# EAGLE design XMICRO-7SEG (EAGLE 6.3)
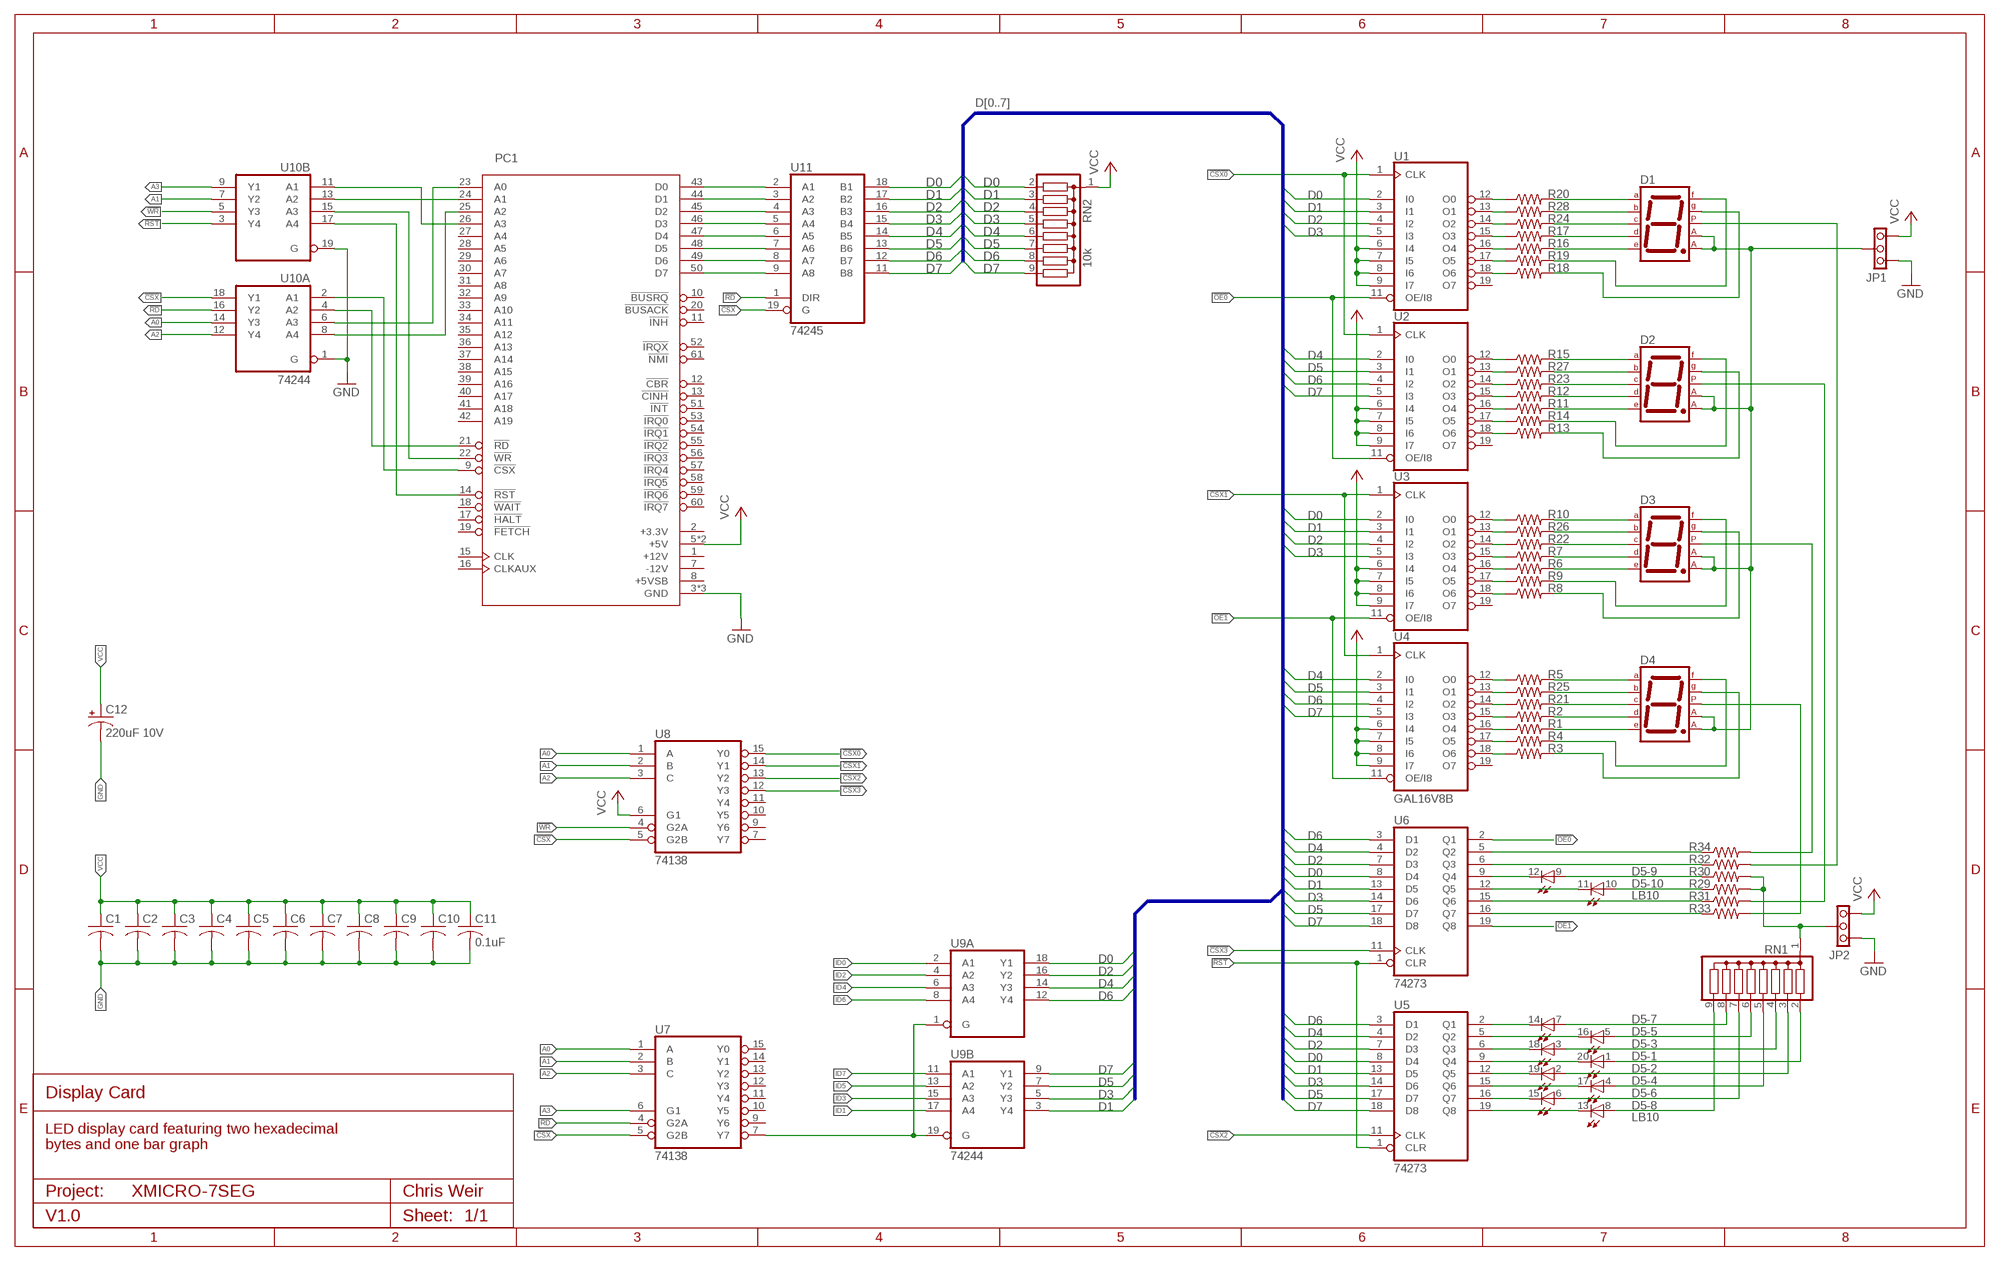
[diagram p0: schematic, sheet 1]

## Parts
C1  0.1uF  C-US025-024X044  [C025-024X044]
C2  0.1uF  C-US025-024X044  [C025-024X044]
C3  0.1uF  C-US025-024X044  [C025-024X044]
C4  0.1uF  C-US025-024X044  [C025-024X044]
C5  0.1uF  C-US025-024X044  [C025-024X044]
C6  0.1uF  C-US025-024X044  [C025-024X044]
C7  0.1uF  C-US025-024X044  [C025-024X044]
C8  0.1uF  C-US025-024X044  [C025-024X044]
C9  0.1uF  C-US025-024X044  [C025-024X044]
C10  0.1uF  C-US025-024X044  [C025-024X044]
C11  0.1uF  C-US025-024X044  [C025-024X044]
C12  220uF 10V  CPOL-US-10-5  [C-10-5]
D1  7SEG-CA  [7SEG-13]
D2  7SEG-CA  [7SEG-13]
D3  7SEG-CA  [7SEG-13]
D4  7SEG-CA  [7SEG-13]
D5  LB10  [LB10]
JP1  PINHD1X3THRU  [1X03]
JP2  PINHD1X3THRU  [1X03]
PC1  XMICRO-BUS-EDGE62M  [EDGE62M]
R1  R-US_0207/10  [0207/10]
R2  R-US_0207/10  [0207/10]
R3  R-US_0207/10  [0207/10]
R4  R-US_0207/10  [0207/10]
R5  R-US_0207/10  [0207/10]
R6  R-US_0207/10  [0207/10]
R7  R-US_0207/10  [0207/10]
R8  R-US_0207/10  [0207/10]
R9  R-US_0207/10  [0207/10]
R10  R-US_0207/10  [0207/10]
R11  R-US_0207/10  [0207/10]
R12  R-US_0207/10  [0207/10]
R13  R-US_0207/10  [0207/10]
R14  R-US_0207/10  [0207/10]
R15  R-US_0207/10  [0207/10]
R16  R-US_0207/10  [0207/10]
R17  R-US_0207/10  [0207/10]
R18  R-US_0207/10  [0207/10]
R19  R-US_0207/10  [0207/10]
R20  R-US_0207/10  [0207/10]
R21  R-US_0207/10  [0207/10]
R22  R-US_0207/10  [0207/10]
R23  R-US_0207/10  [0207/10]
R24  R-US_0207/10  [0207/10]
R25  R-US_0207/10  [0207/10]
R26  R-US_0207/10  [0207/10]
R27  R-US_0207/10  [0207/10]
R28  R-US_0207/10  [0207/10]
R29  R-US_0207/10  [0207/10]
R30  R-US_0207/10  [0207/10]
R31  R-US_0207/10  [0207/10]
R32  R-US_0207/10  [0207/10]
R33  R-US_0207/10  [0207/10]
R34  R-US_0207/10  [0207/10]
RN1  G08R  [SIL9]
RN2  10k  G08R  [SIL9]
U1  GAL16V8B  16V8  [DIL20]
U2  GAL16V8B  16V8  [DIL20]
U3  GAL16V8B  16V8  [DIL20]
U4  GAL16V8B  16V8  [DIL20]
U5  74273  74273N  [DIL20]
U6  74273  74273N  [DIL20]
U7  74138  74LS138N  [DIL16]
U8  74138  74LS138N  [DIL16]
U9  74244  74LS244N  [DIL20]
U10  74244  74LS244N  [DIL20]
U11  74245  74LS245N  [DIL20]

## Nets
!CSX: U7.5(G2B) U8.5(G2B) U10.18(A:Y1) U11.19(G)
!CSX0: U1.1(CLK) U2.1(CLK) U8.15(Y0)
!CSX1: U3.1(CLK) U4.1(CLK) U8.14(Y1)
!CSX2: U5.11(CLK) U8.13(Y2)
!CSX3: U6.11(CLK) U8.12(Y3)
!OE0: U1.11(OE/I8) U2.11(OE/I8) U6.2(Q1)
!OE1: U3.11(OE/I8) U4.11(OE/I8) U6.19(Q8)
!RD: U7.4(G2A) U10.16(A:Y2) U11.1(DIR)
!RST: U5.1(CLR) U6.1(CLR) U10.3(B:Y4)
!WR: U8.4(G2A) U10.5(B:Y3)
A0: U7.1(A) U8.1(A) U10.14(A:Y3)
A1: U7.2(B) U8.2(B) U10.7(B:Y2)
A2: U7.3(C) U8.3(C) U10.12(A:Y4)
A3: U7.6(G1) U10.9(B:Y1)
D0: RN2.2 U1.2(I0) U3.2(I0) U5.8(D4) U6.8(D4) U9.18(A:Y1) U11.18(B1)
D1: RN2.3 U1.3(I1) U3.3(I1) U5.13(D5) U6.13(D5) U9.3(B:Y4) U11.17(B2)
D2: RN2.4 U1.4(I2) U3.4(I2) U5.7(D3) U6.7(D3) U9.16(A:Y2) U11.16(B3)
D3: RN2.5 U1.5(I3) U3.5(I3) U5.14(D6) U6.14(D6) U9.5(B:Y3) U11.15(B4)
D4: RN2.6 U2.2(I0) U4.2(I0) U5.4(D2) U6.4(D2) U9.14(A:Y3) U11.14(B5)
D5: RN2.7 U2.3(I1) U4.3(I1) U5.17(D7) U6.17(D7) U9.7(B:Y2) U11.13(B6)
D6: RN2.8 U2.4(I2) U4.4(I2) U5.3(D1) U6.3(D1) U9.12(A:Y4) U11.12(B7)
D7: RN2.9 U2.5(I3) U4.5(I3) U5.18(D8) U6.18(D8) U9.9(B:Y1) U11.11(B8)
GND [GND]: C1.2 C2.2 C3.2 C4.2 C5.2 C6.2 C7.2 C8.2 C9.2 C10.2 C11.2 C12.- JP1.1 JP2.1 PC1.3(GND) PC1.4(GND) PC1.62(GND) U10.1(A:G) U10.19(B:G)
ID0: U9.2(A:A1)
ID1: U9.17(B:A4)
ID2: U9.4(A:A2)
ID3: U9.15(B:A3)
ID4: U9.6(A:A3)
ID5: U9.13(B:A2)
ID6: U9.8(A:A4)
ID7: U9.11(B:A1)
N$1: D5.12(-9:C) U6.9(Q4)
N$2: D5.11(-10:C) U6.12(Q5)
N$3: R32.1 U6.6(Q3)
N$4: R31.1 U6.15(Q6)
N$5: R33.1 U6.16(Q7)
N$6: D5.1(-1:A) RN1.2
N$7: D5.2(-2:A) RN1.3
N$8: D5.3(-3:A) RN1.4
N$9: D5.4(-4:A) RN1.5
N$10: D5.5(-5:A) RN1.6
N$11: D5.6(-6:A) RN1.7
N$12: D5.7(-7:A) RN1.8
N$13: D5.8(-8:A) RN1.9
N$14: D5.20(-1:C) U5.9(Q4)
N$15: D5.19(-2:C) U5.12(Q5)
N$16: D5.18(-3:C) U5.6(Q3)
N$17: D5.17(-4:C) U5.15(Q6)
N$18: D5.16(-5:C) U5.5(Q2)
N$19: R5.1 U4.12(O0)
N$20: R25.1 U4.13(O1)
N$21: R21.1 U4.14(O2)
N$22: R2.1 U4.15(O3)
N$23: R1.1 U4.16(O4)
N$24: R4.1 U4.17(O5)
N$25: R34.1 U6.5(Q2)
N$26: PC1.43(D0) U11.2(A1)
N$27: R3.1 U4.18(O6)
N$28: D4.7(A) R5.2
N$29: D4.6(B) R25.2
N$30: D4.4(C) R21.2
N$31: D1.3(CA1) D1.8(CA2) D2.3(CA1) D2.8(CA2) D3.3(CA1) D3.8(CA2) D4.3(CA1) D4.8(CA2) JP1.2
N$32: D5.15(-6:C) U5.16(Q7)
N$33: D5.14(-7:C) U5.2(Q1)
N$34: D5.13(-8:C) U5.19(Q8)
N$35: D4.2(D) R2.2
N$36: D4.1(E) R1.2
N$37: D4.9(F) R4.2
N$38: D4.10(G) R3.2
N$39: PC1.44(D1) U11.3(A2)
N$40: PC1.45(D2) U11.4(A3)
N$41: D5.9(-9:A) R30.1
N$42: D5.10(-10:A) R29.1
N$43: PC1.46(D3) U11.5(A4)
N$44: PC1.47(D4) U11.6(A5)
N$45: PC1.48(D5) U11.7(A6)
N$46: D4.5(DP) R33.2
N$47: R10.1 U3.12(O0)
N$48: R26.1 U3.13(O1)
N$49: R22.1 U3.14(O2)
N$50: R7.1 U3.15(O3)
N$51: R6.1 U3.16(O4)
N$52: R9.1 U3.17(O5)
N$53: R8.1 U3.18(O6)
N$54: D3.7(A) R10.2
N$55: D3.6(B) R26.2
N$56: D3.4(C) R22.2
N$57: D3.2(D) R7.2
N$58: D3.1(E) R6.2
N$59: D3.9(F) R9.2
N$60: D3.10(G) R8.2
N$61: PC1.49(D6) U11.8(A7)
N$62: PC1.50(D7) U11.9(A8)
N$63: PC1.9(!CSX) U10.2(A:A1)
N$64: PC1.14(!RST) U10.17(B:A4)
N$65: PC1.21(!RD) U10.4(A:A2)
N$66: PC1.22(!WR) U10.15(B:A3)
N$67: R15.1 U2.12(O0)
N$68: R27.1 U2.13(O1)
N$69: R23.1 U2.14(O2)
N$70: R12.1 U2.15(O3)
N$71: R11.1 U2.16(O4)
N$72: R14.1 U2.17(O5)
N$73: R13.1 U2.18(O6)
N$74: D2.7(A) R15.2
N$75: D2.6(B) R27.2
N$76: D2.4(C) R23.2
N$77: D2.2(D) R12.2
N$78: D2.1(E) R11.2
N$79: D2.9(F) R14.2
N$80: D2.10(G) R13.2
N$81: PC1.23(A0) U10.6(A:A3)
N$82: PC1.24(A1) U10.13(B:A2)
N$83: PC1.25(A2) U10.8(A:A4)
N$84: PC1.26(A3) U10.11(B:A1)
N$85: U7.7(Y7) U9.1(A:G) U9.19(B:G)
N$86: JP2.2 R29.2 R30.2 RN1.1
N$87: R20.1 U1.12(O0)
N$88: R28.1 U1.13(O1)
N$89: R24.1 U1.14(O2)
N$90: R17.1 U1.15(O3)
N$91: R16.1 U1.16(O4)
N$92: R19.1 U1.17(O5)
N$93: R18.1 U1.18(O6)
N$94: D1.7(A) R20.2
N$95: D1.6(B) R28.2
N$96: D1.4(C) R24.2
N$97: D1.2(D) R17.2
N$98: D1.1(E) R16.2
N$99: D1.9(F) R19.2
N$100: D1.10(G) R18.2
N$103: D3.5(DP) R34.2
N$104: D2.5(DP) R31.2
N$105: D1.5(DP) R32.2
VCC: C1.1 C2.1 C3.1 C4.1 C5.1 C6.1 C7.1 C8.1 C9.1 C10.1 C11.1 C12.+ JP1.3 JP2.3 PC1.5(+5V) PC1.6(+5V) RN2.1 U1.6(I4) U1.7(I5) U1.8(I6) U1.9(I7) U2.6(I4) U2.7(I5) U2.8(I6) U2.9(I7) U3.6(I4) U3.7(I5) U3.8(I6) U3.9(I7) U4.6(I4) U4.7(I5) U4.8(I6) U4.9(I7) U8.6(G1)
Unconnected: PC1.1(+12V) PC1.2(+3.3V) PC1.7(-12V) PC1.8(+5VSB) PC1.10(!BUSRQ) PC1.11(!INH) PC1.12(!CBR) PC1.13(!CINH) PC1.15(CLK) PC1.16(CLKAUX) PC1.17(!HALT) PC1.18(!WAIT) PC1.19(!FETCH) PC1.20(!BUSACK) PC1.27(A4) PC1.28(A5) PC1.29(A6) PC1.30(A7) PC1.31(A8) PC1.32(A9) PC1.33(A10) PC1.34(A11) PC1.35(A12) PC1.36(A13) PC1.37(A14) PC1.38(A15) PC1.39(A16) PC1.40(A17) PC1.41(A18) PC1.42(A19) PC1.51(!INT) PC1.52(!IRQX) PC1.53(!IRQ0) PC1.54(!IRQ1) PC1.55(!IRQ2) PC1.56(!IRQ3) PC1.57(!IRQ4) PC1.58(!IRQ5) PC1.59(!IRQ6) PC1.60(!IRQ7) PC1.61(!NMI) U1.19(O7) U2.19(O7) U3.19(O7) U4.19(O7) U7.9(Y6) U7.10(Y5) U7.11(Y4) U7.12(Y3) U7.13(Y2) U7.14(Y1) U7.15(Y0) U8.7(Y7) U8.9(Y6) U8.10(Y5) U8.11(Y4)

## Buses
D[0..7]

## Notes on the sheet
- Display Card
- LED display card featuring two hexadecimal
  bytes and one bar graph
- Project: | Chris Weir
- V1.0 | Sheet:

## Power pins joined to a net without a drawn wire
GND: U1.10(GND) U2.10(GND) U3.10(GND) U4.10(GND) U5.10(GND) U6.10(GND) U7.8(GND) U8.8(GND) U9.10(P:GND) U10.10(P:GND) U11.10(GND)
VCC: U1.20(VCC) U2.20(VCC) U3.20(VCC) U4.20(VCC) U5.20(VCC) U6.20(VCC) U7.16(VCC) U8.16(VCC) U9.20(P:VCC) U10.20(P:VCC) U11.20(VCC)

## Library data of the parts
C1-C11 = resistor:C-US: CAPACITOR, American symbol
C12 = Custom:CPOL-US
D1-D4 = special:7SEG-CA: 7-segment DISPLAY single anode, 13 mm
D5 = led:LB10: LED BLOCK 10-LED bar graph, DIL, Siemens
JP1 JP2 = Custom:PINHD1X3THRU
PC1 = Custom:XMICRO-BUS
R1-R34 = resistor:R-US_: RESISTOR, American symbol
RN1 RN2 = resistor-sil:G08R: SIL RESISTOR; OC_FARNELL: unknown; OC_NEWARK: unknown
U1-U4 = pal:16V8: PAL; MPN: GAL16V8D-7LPN; OC_FARNELL: 9699740; OC_NEWARK: 97K0449
U5 U6 = 74xx-us:74*273: Octal D type FLIP FLOP, clear
U7 U8 = 74xx-us:74*138: 3-line to 8-line DECODER/DEMULTIPLEXER
U9 U10 = 74xx-us:74*244: Octal BUFFER and LINE DRIVER, 3-state
U11 = 74xx-us:74*245: Octal BUS TRANSCEIVER, 3-state

## Net classes
1 GND: width 0.254 mm, clearance 0.381 mm

## Board
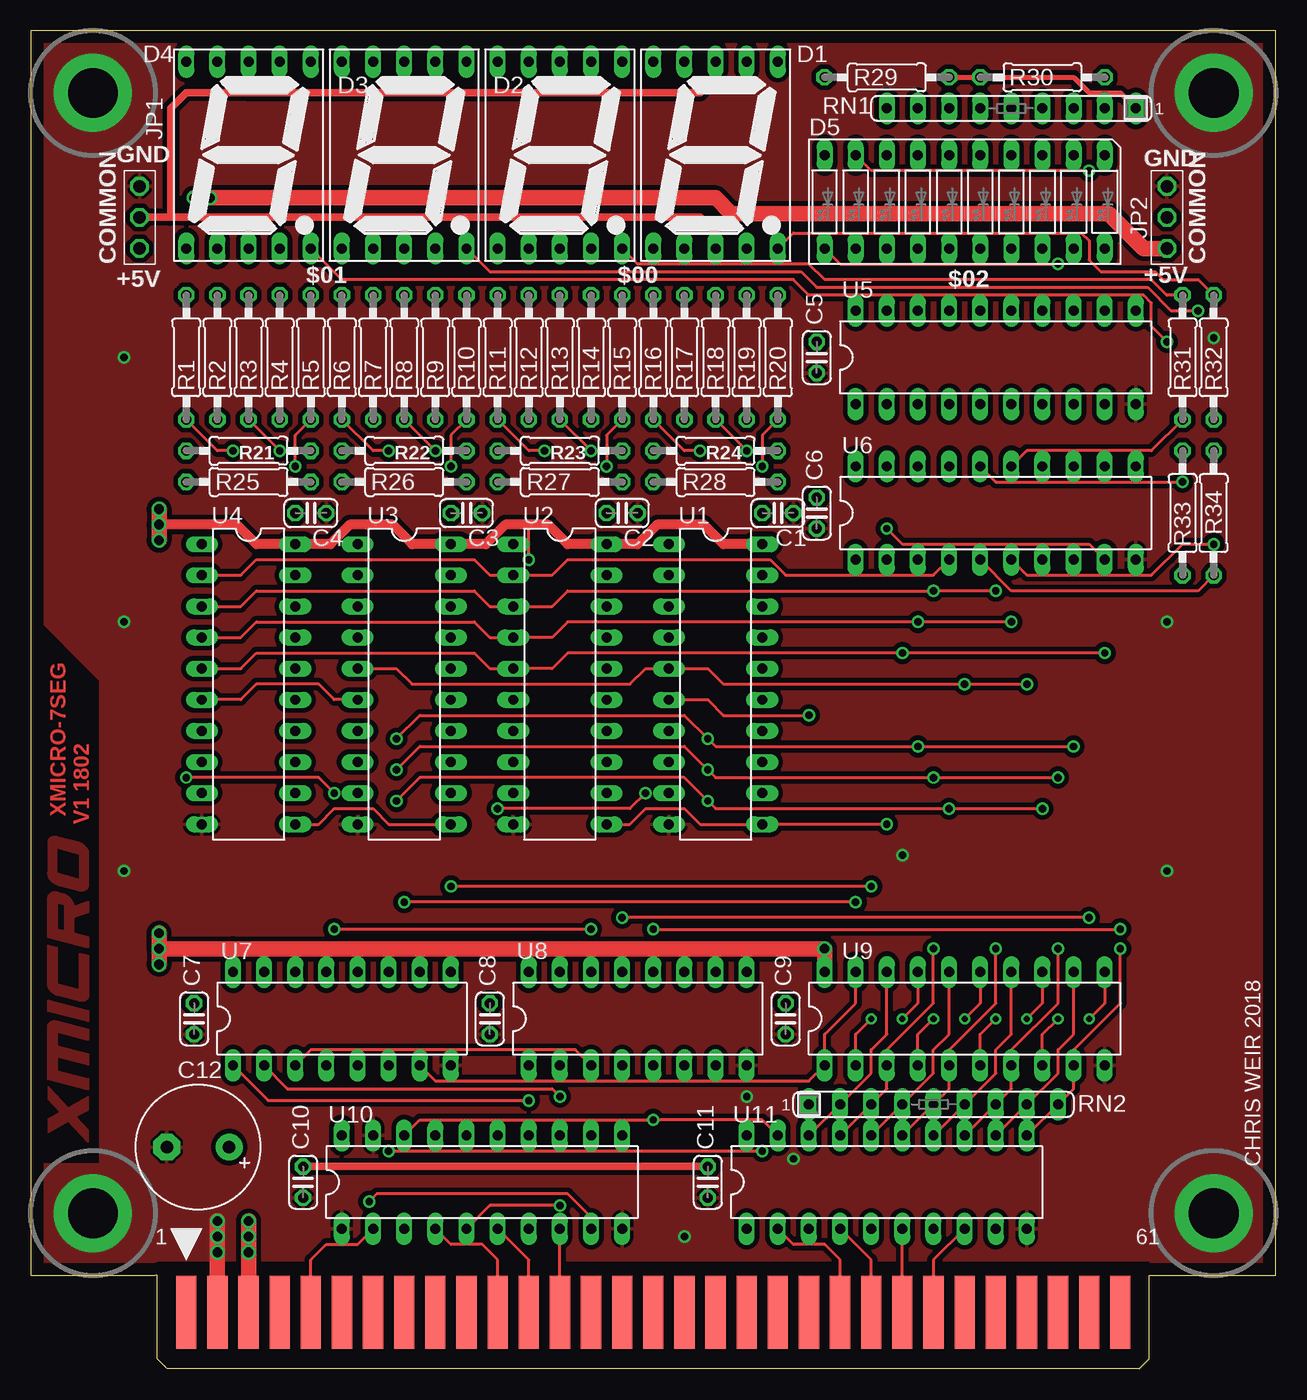
[diagram p1: board, top side]
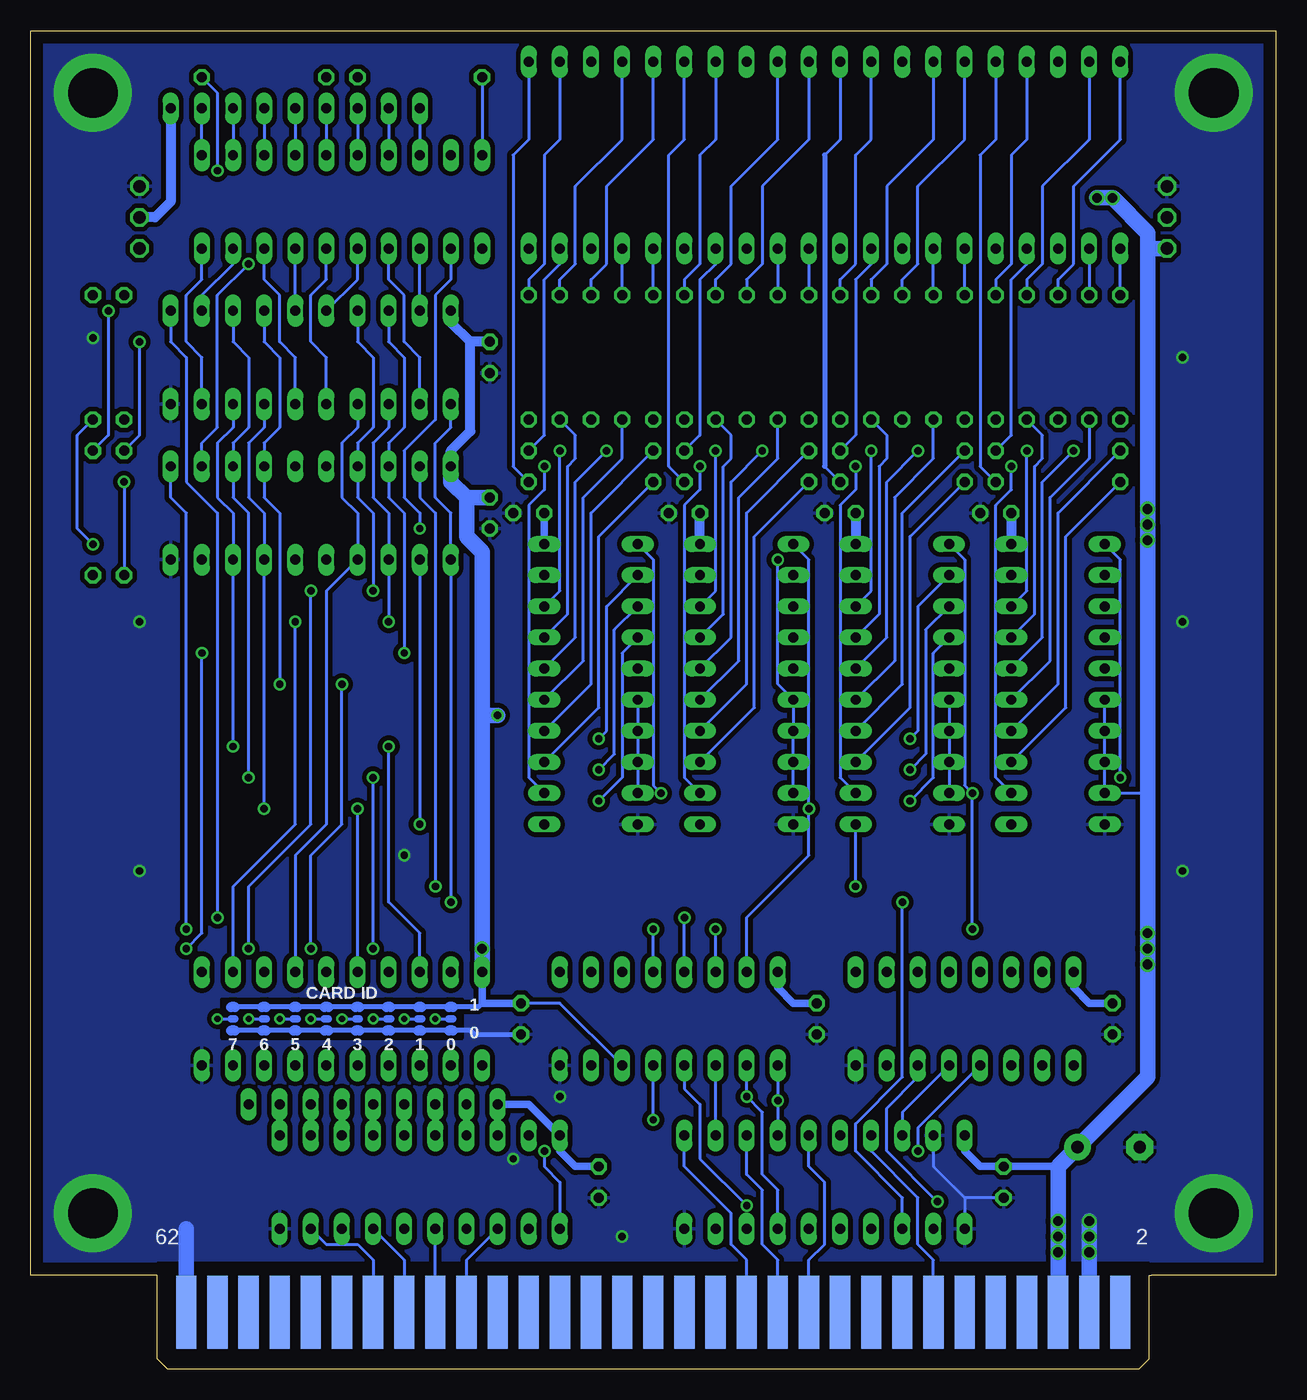
[diagram p2: board, bottom side, seen from below]

Size 101.6 x 109.22 mm. Coordinates in mm from the lower left corner, seen from the top.
Outline: 10.16,7.62 0,7.62 0,109.22 101.6,109.22 101.6,7.62 91.44,7.62
Copper layers (1*16): Top 0.035mm / dielectric 1.5mm / Bottom 0.035mm
Design rules "default *": minimum track width 10mil, minimum drill 0.3mm, track to track 10mil, track to pad 10mil, pad to pad 10mil, via to via 10mil, smd to smd 10mil, copper to edge 40mil, drill to drill 10mil, minimum pad ring 10mil, minimum via ring 8mil, stop-mask expansion 4mil, vias tented up to drill 25mil, thermal gap 10mil
bRestrict: area 66.4,27 to 86,30.2

### Footprints (pad centres in the part's own frame; a part is rotated, then mirrored left to right if it is on the bottom)
C025-024X044 = drill 0.813 octagon: 1 -1.27,0; 2 1.27,0
C-10-5 = drill 1.016 pad 2.184: + -2.54,0 | drill 1.016 pad 2.184 octagon: - 2.54,0
7SEG-13 = drill 0.813 long: 1 -5.08,-7.62; 2 -2.54,-7.62; 3 0,-7.62; 4 2.54,-7.62; 5 5.08,-7.62; 6 5.08,7.62; 7 2.54,7.62; 8 0,7.62; 9 -2.54,7.62; 10 -5.08,7.62
LB10 = drill 0.813 long: 1 -11.43,-3.81; 2 -8.89,-3.81; 3 -6.35,-3.81; 4 -3.81,-3.81; 5 -1.27,-3.81; 6 1.27,-3.81; 7 3.81,-3.81; 8 6.35,-3.81; 9 8.89,-3.81; 10 11.43,-3.81; 11 11.43,3.81; 12 8.89,3.81; 13 6.35,3.81; 14 3.81,3.81; 15 1.27,3.81; 16 -1.27,3.81; 17 -3.81,3.81; 18 -6.35,3.81; 19 -8.89,3.81; 20 -11.43,3.81
1X03 = drill 1.016 octagon: 1 -2.54,0; 2 0,0; 3 2.54,0
EDGE62M = smd 1.651 x 5.969: 1 -38.1,-3.01; 3 -35.56,-3.01; 5 -33.02,-3.01; 7 -30.48,-3.01; 9 -27.94,-3.01; 11 -25.4,-3.01; 13 -22.86,-3.01; 15 -20.32,-3.01; 17 -17.78,-3.01; 19 -15.24,-3.01; 21 -12.7,-3.01; 23 -10.16,-3.01; 25 -7.62,-3.01; 27 -5.08,-3.01; 29 -2.54,-3.01; 31 0,-3.01; 33 2.54,-3.01; 35 5.08,-3.01; 37 7.62,-3.01; 39 10.16,-3.01; 41 12.7,-3.01; 43 15.24,-3.01; 45 17.78,-3.01; 47 20.32,-3.01; 49 22.86,-3.01; 51 25.4,-3.01; 53 27.94,-3.01; 55 30.48,-3.01; 57 33.02,-3.01; 59 35.56,-3.01; 61 38.1,-3.01 | smd 1.651 x 5.969 bottom: 2 -38.1,-3.01; 4 -35.56,-3.01; 6 -33.02,-3.01; 8 -30.48,-3.01; 10 -27.94,-3.01; 12 -25.4,-3.01; 14 -22.86,-3.01; 16 -20.32,-3.01; 18 -17.78,-3.01; 20 -15.24,-3.01; 22 -12.7,-3.01; 24 -10.16,-3.01; 26 -7.62,-3.01; 28 -5.08,-3.01; 30 -2.54,-3.01; 32 0,-3.01; 34 2.54,-3.01; 36 5.08,-3.01; 38 7.62,-3.01; 40 10.16,-3.01; 42 12.7,-3.01; 44 15.24,-3.01; 46 17.78,-3.01; 48 20.32,-3.01; 50 22.86,-3.01; 52 25.4,-3.01; 54 27.94,-3.01; 56 30.48,-3.01; 58 33.02,-3.01; 60 35.56,-3.01; 62 38.1,-3.01
0207/10 = drill 0.813 octagon: 1 -5.08,0; 2 5.08,0
SIL9 = drill 0.813 long: 1 -10.16,0; 2 -7.62,0; 3 -5.08,0; 4 -2.54,0; 5 0,0; 6 2.54,0; 7 5.08,0; 8 7.62,0; 9 10.16,0
DIL20 = drill 0.813 long: 1 -11.43,-3.81; 2 -8.89,-3.81; 3 -6.35,-3.81; 4 -3.81,-3.81; 5 -1.27,-3.81; 6 1.27,-3.81; 7 3.81,-3.81; 8 6.35,-3.81; 9 8.89,-3.81; 10 11.43,-3.81; 11 11.43,3.81; 12 8.89,3.81; 13 6.35,3.81; 14 3.81,3.81; 15 1.27,3.81; 16 -1.27,3.81; 17 -3.81,3.81; 18 -6.35,3.81; 19 -8.89,3.81; 20 -11.43,3.81
DIL16 = drill 0.813 long: 1 -8.89,-3.81; 2 -6.35,-3.81; 3 -3.81,-3.81; 4 -1.27,-3.81; 5 1.27,-3.81; 6 3.81,-3.81; 7 6.35,-3.81; 8 8.89,-3.81; 9 8.89,3.81; 10 6.35,3.81; 11 3.81,3.81; 12 1.27,3.81; 13 -1.27,3.81; 14 -3.81,3.81; 15 -6.35,3.81; 16 -8.89,3.81

### Placement (x,y rotation side)
C1  60.96,69.85 0 top
C2  48.26,69.85 0 top
C3  35.56,69.85 0 top
C4  22.86,69.85 0 top
C5  64.14,82.55 270 top
C6  64.14,69.85 270 top
C7  13.34,28.57 270 top
C8  37.47,28.57 270 top
C9  61.59,28.57 270 top
C10  22.23,15.24 270 top
C11  55.24,15.24 270 top
C12  13.65,18.1 180 top
D1  55.88,99.06 0 top
D2  43.18,99.06 0 top
D3  30.48,99.06 0 top
D4  17.78,99.06 0 top
D5  76.2,95.25 180 top
JP1  8.89,93.98 270 top
JP2  92.71,93.98 270 top
PC1  50.8,7.62 0 top
R1  12.7,82.55 90 top
R2  15.24,82.55 90 top
R3  17.78,82.55 90 top
R4  20.32,82.55 90 top
R5  22.86,82.55 90 top
R6  25.4,82.55 90 top
R7  27.94,82.55 90 top
R8  30.48,82.55 90 top
R9  33.02,82.55 90 top
R10  35.56,82.55 90 top
R11  38.1,82.55 90 top
R12  40.64,82.55 90 top
R13  43.18,82.55 90 top
R14  45.72,82.55 90 top
R15  48.26,82.55 90 top
R16  50.8,82.55 90 top
R17  53.34,82.55 90 top
R18  55.88,82.55 90 top
R19  58.42,82.55 90 top
R20  60.96,82.55 90 top
R21  17.78,74.93 0 top
R22  30.48,74.93 0 top
R23  43.18,74.93 0 top
R24  55.88,74.93 0 top
R25  17.78,72.39 0 top
R26  30.48,72.39 0 top
R27  43.18,72.39 0 top
R28  55.88,72.39 0 top
R29  69.85,105.41 0 top
R30  82.55,105.41 180 top
R31  93.98,82.55 90 top
R32  96.52,82.55 90 top
R33  93.98,69.85 90 top
R34  96.52,69.85 90 top
RN1  80.01,102.87 180 top
RN2  73.66,21.59 0 top
U1  55.88,55.88 270 top
U2  43.18,55.88 270 top
U3  30.48,55.88 270 top
U4  17.78,55.88 270 top
U5  78.74,82.55 0 top
U6  78.74,69.85 0 top
U7  25.4,28.57 0 top
U8  49.53,28.57 0 top
U9  76.2,28.57 0 top
U10  36.83,15.24 0 top
U11  69.85,15.24 0 top

### Tracks (layer width: path | path; a pad name or v marks a point on that pad's centre or on a via)
!CSX  (via drill 0.6)
  Top 0.254: U10.18 31.75,20.32 v50.8,20.32 59.69,20.32 U11.19
  Bottom 0.254: v50.8,20.32 U8.5 | U7.5 30.48,20.96 U10.18
!CSX0  (via drill 0.6)
  Top 0.254: v50.16,46.99 48.9,45.72 v38.1,45.72
  Bottom 0.254: U1.1 50.8,66.04 50.8,47.62 v50.16,46.99 | U2.1 38.1,66.04 v38.1,45.72 38.1,41.91 43.18,36.83 U8.15
!CSX1  (via drill 0.6)
  Top 0.254: v24.77,46.99 23.5,48.26 v12.7,48.26 | v45.72,35.88 v24.77,35.88
  Bottom 0.254: U3.1 25.4,66.04 25.4,47.62 v24.77,46.99 v24.77,35.88 | v12.7,48.26 12.7,66.04 U4.1 | U8.14 v45.72,35.88
!CSX2  (via drill 0.6)
  Top 0.254: v86.36,36.83 v48.26,36.83
  Bottom 0.254: U8.13 v48.26,36.83 | v86.36,36.83 86.36,69.85 88.9,72.39 88.9,82.55 90.17,83.82 U5.11
!CSX3  (via drill 0.6)
  Top 0.254: v50.8,35.88 v88.9,35.88
  Bottom 0.254: U8.12 v50.8,35.88 | v88.9,35.88 88.9,69.85 90.17,71.12 U6.11
!OE0  (via drill 0.6)
  Top 0.254: U2.11 48.9,44.45 50.16,45.72 53.34,45.72 54.61,44.45 U1.11 v69.85,44.45
  Bottom 0.254: U6.2 v69.85,44.45
!OE1  (via drill 0.6)
  Top 0.254: U4.11 23.5,44.45 24.77,45.72 27.94,45.72 29.21,44.45 U3.11 | v68.58,39.37 v34.29,39.37
  Bottom 0.254: U6.19 69.85,71.12 68.58,69.85 v68.58,39.37 | v34.29,39.37 U3.11
!RD  (via drill 0.6)
  Top 0.254: U10.16 35.56,17.78 | 35.56,17.78 v59.69,17.78 | v29.21,17.78 35.56,17.78
  Bottom 0.254: v59.69,17.78 59.69,16.51 58.42,15.24 U11.1 | U7.4 29.21,19.68 v29.21,17.78
!RST  (via drill 0.6)
  Top 0.254: v67.31,38.1 v30.48,38.1
  Bottom 0.254: U5.1 67.31,76.84 68.58,75.56 68.58,71.12 67.31,69.85 U6.1 v67.31,38.1 | U10.3 30.48,13.97 34.29,17.78 34.29,20 30.48,23.81 v30.48,38.1
!WR  (via drill 0.6)
  Top 0.254: v43.18,13.34 37.47,13.34 U10.5
  Bottom 0.254: U8.4 48.26,22.86 46.99,21.59 46.99,17.14 v43.18,13.34
A0  (via drill 0.6)
  Top 0.254: U7.1 19.37,21.91 v40.64,21.91
  Bottom 0.254: U8.1 v40.64,21.91 U10.14
A1  (via drill 0.6)
  Top 0.254: U7.2 20.95,22.86 42.55,22.86 v43.18,22.23
  Bottom 0.254: U10.7 40.64,14.61 41.91,15.88 41.91,20.96 v43.18,22.23 U8.2
A2
  Top 0.254: U8.3 44.45,26.04 22.86,26.04 U7.3
  Bottom 0.254: U10.12 U8.3
A3  (via drill 0.6)
  Top 0.254: U10.9 45.72,12.38 43.81,14.29 28.26,14.29 v27.62,13.65
  Bottom 0.254: v27.62,13.65 31.75,17.78 31.75,21.27 29.21,23.81 U7.6
D0  (via drill 0.6)
  Top 0.254: v29.84,51.43 31.75,53.34 53.34,53.34 v55.24,51.43 55.88,50.8 v72.39,50.8 v85.09,50.8 | U9.18 69.85,27.3 68.58,26.04 68.58,24.13 RN2.2 U11.18
  Bottom 0.254: U5.8 85.09,76.84 86.36,75.56 86.36,71.12 85.09,69.85 U6.8 v85.09,50.8 | U3.2 29.21,62.23 29.21,52.07 v29.84,51.43 | v55.24,51.43 54.61,52.07 54.61,62.23 U1.2 | U9.18 69.85,35.56 72.39,38.1 v72.39,50.8
D1  (via drill 0.6)
  Top 0.254: v29.84,48.89 31.75,50.8 53.34,50.8 v55.24,48.89 55.88,48.26 v73.66,48.26 v83.82,48.26 | v73.66,34.29 73.66,29.85 69.85,26.04 U9.3 69.85,22.86 RN2.3 U11.17
  Bottom 0.254: U5.13 85.09,83.82 83.82,82.55 83.82,76.84 85.09,75.56 U6.13 85.09,71.12 83.82,69.85 v83.82,48.26 | U3.3 28.57,60.32 28.57,50.16 v29.84,48.89 | v55.24,48.89 53.98,50.16 53.98,60.32 U1.3 | v73.66,34.29 v73.66,48.26
D2  (via drill 0.6)
  Top 0.254: v29.84,46.35 31.75,48.26 53.34,48.26 v55.24,46.35 55.88,45.72 v74.93,45.72 v82.55,45.72 | U9.16 74.93,27.3 73.66,26.04 73.66,24.13 RN2.4 U11.16
  Bottom 0.254: U5.7 82.55,76.84 83.82,75.56 83.82,71.12 82.55,69.85 U6.7 v82.55,45.72 | U1.4 53.34,58.42 53.34,48.26 v55.24,46.35 | v29.84,46.35 27.94,48.26 27.94,58.42 U3.4 | U9.16 v74.93,45.72
D3  (via drill 0.6)
  Top 0.254: U3.5 29.84,57.15 31.11,55.88 48.9,55.88 50.16,57.15 U1.5 55.24,57.15 56.52,55.88 v76.2,55.88 v81.28,55.88 | v78.74,34.29 78.74,29.85 74.93,26.04 U9.5 74.93,22.86 RN2.5 U11.15
  Bottom 0.254: U5.14 82.55,83.82 81.28,82.55 81.28,76.84 82.55,75.56 U6.14 82.55,71.12 81.28,69.85 v81.28,55.88 | v78.74,34.29 78.74,41.91 76.2,44.45 v76.2,55.88
D4
  Top 0.254: U4.2 17.14,64.77 18.41,66.04 36.2,66.04 37.47,64.77 U2.2 42.55,64.77 43.81,66.04 60.33,66.04 61.59,64.77 73.66,64.77 U6.4 | U11.14 74.3,19.68 RN2.6 78.74,24.13 78.74,26.04 80.01,27.3 U9.14
  Bottom 0.254: U5.4 74.93,76.84 76.2,75.56 76.2,71.12 74.93,69.85 U6.4 77.47,63.5 77.47,44.45 80.01,41.91 U9.14
D5  (via drill 0.6)
  Top 0.254: U4.3 17.14,62.23 18.41,63.5 36.2,63.5 37.47,62.23 U2.3 42.55,62.23 43.81,63.5 v73.66,63.5 v78.74,63.5 | v83.82,34.29 83.82,29.85 80.01,26.04 U9.7 80.01,22.86 RN2.7 U11.13
  Bottom 0.254: U5.17 74.93,83.82 73.66,82.55 73.66,76.84 74.93,75.56 U6.17 74.93,71.12 73.66,69.85 v73.66,63.5 | v83.82,34.29 83.82,39.37 78.74,44.45 v78.74,63.5
D6  (via drill 0.6)
  Top 0.254: U4.4 17.14,59.69 18.41,60.96 36.2,60.96 37.47,59.69 U2.4 42.55,59.69 43.81,60.96 v72.39,60.96 v80.01,60.96 | U9.12 85.09,27.3 83.82,26.04 83.82,24.13 RN2.8 U11.12
  Bottom 0.254: U5.3 72.39,76.84 73.66,75.56 73.66,71.12 72.39,69.85 U6.3 v72.39,60.96 | U9.12 85.09,39.37 80.01,44.45 v80.01,60.96
D7  (via drill 0.6)
  Top 0.254: U4.5 17.14,57.15 18.41,58.42 36.2,58.42 37.47,57.15 U2.5 42.55,57.15 43.81,58.42 v71.12,58.42 v87.63,58.42 | v88.9,34.29 88.9,29.85 85.09,26.04 U9.9 85.09,22.86 RN2.9 U11.11
  Bottom 0.254: U5.18 72.39,83.82 71.12,82.55 71.12,76.84 72.39,75.56 U6.18 72.39,71.12 71.12,69.85 v71.12,58.42 | v88.9,34.29 87.63,35.56 v87.63,58.42
GND  (via drill 0.6, 0.8, 4.06 pad 6.35)
  Top 1.27: PC1.4 v15.24,9.53 v15.24,10.79 v15.24,12.07
  Bottom 0.254: U10.19 27.94,16.51 25.4,13.97 | 25.4,13.97 U10.1 | C10.2 25.4,13.97
  Bottom 0.406: 67.15,27.62 65.72,27.62 65.41,27.3 C9.2 | 67.47,27.62 69.69,27.62 | 70.01,27.62 72.23,27.62 | 72.55,27.62 74.77,27.62 | 75.09,27.62 77.31,27.62 | 77.63,27.62 79.85,27.62 | 80.17,27.62 82.39,27.62 | 82.71,27.62 84.93,27.62
  Bottom 0.813: 67.15,27.62 67.47,27.62 | 69.69,27.62 70.01,27.62 | 72.23,27.62 72.55,27.62 | 74.77,27.62 75.09,27.62 | 77.31,27.62 77.63,27.62 | 79.85,27.62 80.17,27.62 | 82.39,27.62 82.71,27.62 | 84.93,27.62 85.25,27.62
  Bottom 1.27: PC1.4 v15.24,9.53 v15.24,10.79 v15.24,12.07 | PC1.62 88.9,11.43
  other vias: 96.52,12.7 5.08,12.7 96.52,104.14 5.08,104.14 7.62,40.64 7.62,60.96 7.62,82.55 71.12,41.91 92.71,40.64 92.71,60.96 96.52,84.14 58.42,22.23 62.23,17.14 53.34,10.79
  pour Bottom: 91.44,7.62 101.6,7.62 101.6,109.22 0,109.22 0,7.62 10.16,7.62 10.16,8.89 91.44,8.89
  pour Top: 0,7.62 0,16.64 5.71,16.64 5.71,56.2 0,61.91 0,109.22 101.6,109.22 101.6,7.62 91.44,7.62 91.44,8.89 10.16,8.89 10.16,7.62
ID0  (via drill 0.5)
  Top 0.254: U9.2 67.31,27.3 v68.58,28.57
  Bottom 0.254: v68.58,28.57 67.47,28.57
  Bottom 0.61: 67.47,28.57 67.15,28.57
ID1  (via drill 0.5)
  Top 0.254: U9.17 72.39,29.85 v71.12,28.57
  Bottom 0.254: v71.12,28.57 70.01,28.57
  Bottom 0.61: 70.01,28.57 69.69,28.57
ID2  (via drill 0.5)
  Top 0.254: U9.4 72.39,27.3 v73.66,28.57
  Bottom 0.254: v73.66,28.57 72.55,28.57
  Bottom 0.61: 72.55,28.57 72.23,28.57
ID3  (via drill 0.5)
  Top 0.254: U9.15 77.47,29.85 v76.2,28.57
  Bottom 0.254: v76.2,28.57 75.09,28.57
  Bottom 0.61: 75.09,28.57 74.77,28.57
ID4  (via drill 0.5)
  Top 0.254: U9.6 77.47,27.3 v78.74,28.57
  Bottom 0.254: v78.74,28.57 77.63,28.57
  Bottom 0.61: 77.63,28.57 77.31,28.57
ID5  (via drill 0.5)
  Top 0.254: U9.13 82.55,29.85 v81.28,28.57
  Bottom 0.254: v81.28,28.57 80.17,28.57
  Bottom 0.61: 80.17,28.57 79.85,28.57
ID6  (via drill 0.5)
  Top 0.254: U9.8 82.55,27.3 v83.82,28.57
  Bottom 0.254: v83.82,28.57 82.71,28.57
  Bottom 0.61: 82.71,28.57 82.39,28.57
ID7  (via drill 0.5)
  Top 0.254: U9.11 87.63,29.85 v86.36,28.57
  Bottom 0.254: v86.36,28.57 85.25,28.57
  Bottom 0.61: 85.25,28.57 84.93,28.57
N$1  (via drill 0.6)
  Top 0.254: v69.85,68.58 71.12,67.31 86.36,67.31 U6.9
  Bottom 0.254: D5.12 67.31,88.9 68.58,87.63 68.58,77.47 71.12,74.93 71.12,71.12 69.85,69.85 v69.85,68.58
N$2  (via drill 0.6)
  Top 0.254: D5.11 66.04,90.17 v83.82,90.17
  Bottom 0.254: U6.12 87.63,75.56 86.36,76.84 86.36,87.63 v83.82,90.17
N$3  (via drill 0.6)
  Top 0.254: U6.6 81.28,64.77 91.44,64.77 93.98,67.31 v96.52,67.31
  Bottom 0.254: v96.52,67.31 97.79,68.58 97.79,76.2 R32.1
N$4
  Top 0.254: R31.1 91.44,74.93 81.28,74.93 U6.15
N$5  (via drill 0.6)
  Top 0.254: U6.16 78.74,72.39 v93.98,72.39
  Bottom 0.254: v93.98,72.39 R33.1
N$6
  Bottom 0.254: D5.1 RN1.2
N$7
  Bottom 0.254: RN1.3 D5.2
N$8
  Bottom 0.254: RN1.4 D5.3
N$9
  Bottom 0.254: RN1.5 D5.4
N$10
  Bottom 0.254: RN1.6 D5.5
N$11
  Bottom 0.254: RN1.7 D5.6
N$12
  Bottom 0.254: RN1.8 D5.7
N$13
  Bottom 0.254: RN1.9 D5.8
N$14
  Bottom 0.254: U5.9 87.63,82.55 88.9,83.82 88.9,87.63 87.63,88.9 D5.20
N$15
  Bottom 0.254: U5.12 87.63,87.63 85.09,90.17 D5.19
N$16
  Bottom 0.254: U5.6 80.01,82.55 81.28,83.82 81.28,87.63 82.55,88.9 D5.18
N$17
  Bottom 0.254: U5.15 D5.17
N$18
  Bottom 0.254: U5.5 77.47,82.55 78.74,83.82 78.74,87.63 77.47,88.9 D5.16
N$19  (via drill 0.6)
  Top 0.254: v21.59,73.66 21.59,76.2 R5.1
  Bottom 0.254: U4.12 22.86,48.26 22.86,70.48 21.59,71.76 v21.59,73.66
N$20
  Bottom 0.254: U4.13 17.14,53.97 17.14,67.95 R25.1
N$21
  Bottom 0.254: U4.14 17.78,55.88 17.78,69.85 R21.1
N$22
  Bottom 0.254: U4.15 18.41,57.78 18.41,71.12 15.24,74.3 R2.1
N$23  (via drill 0.6)
  Top 0.254: v16.51,74.93 15.24,74.93 R1.1
  Bottom 0.254: U4.16 19.05,59.69 19.05,72.39 v16.51,74.93
N$24
  Bottom 0.254: U4.17 19.68,61.59 19.68,73.66 19.05,74.3 19.05,76.2 R4.1
N$25
  Top 0.254: R34.1 95.25,63.5 80.01,63.5 U6.5
N$26
  Top 0.254: PC1.43 66.04,8.89 64.77,10.16 62.23,10.16 U11.2
N$27  (via drill 0.6)
  Top 0.254: R3.1 v20.32,74.93
  Bottom 0.254: U4.18 20.32,63.5 v20.32,74.93
N$28
  Bottom 0.254: D4.7 20.32,100.33 21.59,99.06 21.59,90.17 22.86,88.9 R5.2
N$29
  Bottom 0.254: D4.6 22.86,100.33 24.13,99.06 24.13,73.66 R25.2
N$30
  Bottom 0.254: R21.2 21.59,76.2 21.59,88.9 20.32,90.17 D4.4
N$31
  Top 0.61: D4.3 17.78,93.98 | 17.78,93.98 11.43,93.98 | 11.43,93.98 JP1.2 | 17.78,93.98 30.48,93.98 | 30.48,93.98 43.18,93.98 | 43.18,93.98 54.61,93.98 55.88,92.71 D1.3 | D2.3 43.18,93.98 | D3.3 30.48,93.98 | D4.8 17.78,104.14 | 17.78,104.14 30.48,104.14 | 30.48,104.14 43.18,104.14 | 43.18,104.14 54.61,104.14 55.88,105.41 D1.8 | D2.8 43.18,104.14 | D3.8 30.48,104.14 | 17.78,104.14 12.7,104.14 11.43,102.87 11.43,93.98
N$32
  Bottom 0.254: U5.16 74.93,88.9 D5.15
N$33
  Bottom 0.254: U5.2 69.85,82.55 71.12,83.82 71.12,87.63 72.39,88.9 D5.14
N$34
  Bottom 0.254: U5.19 D5.13
N$35
  Bottom 0.254: D4.2 R2.2
N$36
  Bottom 0.254: R1.2 D4.1
N$37
  Bottom 0.254: D4.9 15.24,100.33 19.05,96.52 19.05,90.17 20.32,88.9 R4.2
N$38
  Bottom 0.254: R3.2 17.78,88.9 16.51,90.17 16.51,96.52 12.7,100.33 D4.10
N$39
  Bottom 0.254: PC1.44 66.04,8.89 U11.3
N$40
  Top 0.254: PC1.45 68.58,8.89 U11.4
N$41  (via drill 0.6)
  Top 0.254: v86.36,97.79 68.58,97.79 D5.9
  Bottom 0.254: R30.1 86.36,104.14 v86.36,97.79
N$42
  Bottom 0.254: R29.1 D5.10
N$43
  Bottom 0.254: PC1.46 U11.5
N$44
  Top 0.254: PC1.47 U11.6
N$45
  Bottom 0.254: U11.7 71.12,8.89 PC1.48
N$46  (via drill 0.6)
  Top 0.254: v92.71,83.82 91.44,85.09 91.44,87 90.81,87.63 63.5,87.63 62.23,88.9 25.4,88.9 D4.5
  Bottom 0.254: R33.2 92.71,76.2 v92.71,83.82
N$47  (via drill 0.6)
  Top 0.254: R10.1 34.29,76.2 v34.29,73.66
  Bottom 0.254: v34.29,73.66 34.29,71.76 35.56,70.48 35.56,48.26 U3.12
N$48
  Bottom 0.254: U3.13 29.84,53.97 29.84,67.95 R26.1
N$49
  Bottom 0.254: U3.14 30.48,55.88 30.48,69.85 R22.1
N$50
  Bottom 0.254: U3.15 31.11,57.78 31.11,71.12 27.94,74.3 R7.1
N$51  (via drill 0.6)
  Top 0.254: v29.21,74.93 27.94,74.93 R6.1
  Bottom 0.254: U3.16 31.75,59.69 31.75,72.39 v29.21,74.93
N$52
  Bottom 0.254: R9.1 31.75,76.2 31.75,74.3 32.38,73.66 32.38,61.59 U3.17
N$53  (via drill 0.6)
  Top 0.254: v33.02,74.93 R8.1
  Bottom 0.254: U3.18 33.02,63.5 v33.02,74.93
N$54
  Bottom 0.254: R10.2 35.56,88.9 34.29,90.17 34.29,99.06 33.02,100.33 D3.7
N$55
  Bottom 0.254: D3.6 35.56,100.33 36.83,99.06 | 36.83,73.66 R26.2
  Bottom 0.406: 36.83,99.06 36.83,73.66
N$56
  Bottom 0.254: D3.4 33.02,90.17 34.29,88.9 34.29,76.2 R22.2
N$57
  Bottom 0.254: R7.2 D3.2
N$58
  Bottom 0.254: R6.2 D3.1
N$59
  Bottom 0.254: D3.9 27.94,100.33 31.75,96.52 31.75,90.17 33.02,88.9 R9.2
N$60
  Bottom 0.254: R8.2 30.48,88.9 29.21,90.17 29.21,96.52 25.4,100.33 D3.10
N$61
  Top 0.254: U11.8 73.66,8.89 PC1.49
N$62
  Bottom 0.254: U11.9 77.47,10.16 74.93,10.16 73.66,8.89 PC1.50
N$63
  Top 0.254: PC1.9 22.86,8.89 24.13,10.16 26.67,10.16 U10.2
N$64
  Bottom 0.254: PC1.14 27.94,8.89 29.21,10.16 29.21,13.97 33.02,17.78 U10.17
N$65
  Top 0.254: PC1.21 38.1,8.89 36.83,10.16 34.29,10.16 U10.4
N$66
  Bottom 0.254: PC1.22 38.1,8.89 36.83,10.16 36.83,15.24 38.1,16.51 U10.15
N$67  (via drill 0.6)
  Top 0.254: R15.1 46.99,76.2 v46.99,73.66
  Bottom 0.254: v46.99,73.66 46.99,71.76 48.26,70.48 48.26,48.26 U2.12
N$68
  Bottom 0.254: U2.13 42.55,53.97 42.55,67.95 R27.1
N$69
  Bottom 0.254: U2.14 43.18,55.88 43.18,69.85 R23.1
N$70
  Bottom 0.254: U2.15 43.81,57.78 43.81,71.12 40.64,74.3 R12.1
N$71  (via drill 0.6)
  Top 0.254: v41.91,74.93 40.64,74.93 R11.1
  Bottom 0.254: U2.16 44.45,59.69 44.45,72.39 v41.91,74.93
N$72
  Bottom 0.254: U2.17 45.09,61.59 45.09,73.66 44.45,74.3 44.45,76.2 R14.1
N$73  (via drill 0.6)
  Top 0.254: v45.72,74.93 R13.1
  Bottom 0.254: U2.18 45.72,63.5 v45.72,74.93
N$74
  Bottom 0.254: D2.7 45.72,100.33 46.99,99.06 46.99,90.17 48.26,88.9 R15.2
N$75
  Bottom 0.254: R27.2 49.53,73.66 49.53,99.06 48.26,100.33 D2.6
N$76
  Bottom 0.254: D2.4 45.72,90.17 46.99,88.9 46.99,76.2 R23.2
N$77
  Bottom 0.254: D2.2 R12.2
N$78
  Bottom 0.254: D2.1 R11.2
N$79
  Bottom 0.254: R14.2 45.72,88.9 44.45,90.17 44.45,96.52 40.64,100.33 D2.9
N$80
  Bottom 0.254: D2.10 38.1,100.33 41.91,96.52 41.91,90.17 43.18,88.9 R13.2
N$81
  Top 0.254: PC1.23 40.64,8.89 U10.6
N$82
  Bottom 0.254: PC1.24 40.64,8.89 41.91,10.16 41.91,14.61 43.18,15.88 U10.13
N$83
  Top 0.254: PC1.25 U10.8
N$84
  Bottom 0.254: PC1.26 43.18,8.89 44.45,10.16 44.45,12.7 48.26,16.51 U10.11
N$85
  Top 0.254: U9.19 67.31,29.85 64.77,27.3 U9.1 63.5,23.5 33.02,23.5 U7.7
N$86
  Top 0.406: R29.2 R30.2 85.09,105.41 86.36,104.14 88.9,104.14 RN1.1
  Bottom 0.813: RN1.1 90.17,95.25 91.44,93.98 JP2.2
N$87  (via drill 0.6)
  Top 0.254: R20.1 59.69,76.2 v59.69,73.66
  Bottom 0.254: v59.69,73.66 59.69,71.76 60.96,70.48 60.96,48.26 U1.12
N$88
  Bottom 0.254: U1.13 55.24,53.97 55.24,67.95 R28.1
N$89
  Bottom 0.254: U1.14 55.88,55.88 55.88,69.85 R24.1
N$90
  Bottom 0.254: U1.15 56.52,57.78 56.52,71.12 53.34,74.3 R17.1
N$91  (via drill 0.6)
  Top 0.254: v54.61,74.93 53.34,74.93 R16.1
  Bottom 0.254: U1.16 57.15,59.69 57.15,72.39 v54.61,74.93
N$92
  Bottom 0.254: U1.17 57.78,61.59 57.78,73.66 57.15,74.3 57.15,76.2 R19.1
N$93  (via drill 0.6)
  Top 0.254: v58.42,74.93 R18.1
  Bottom 0.254: U1.18 58.42,63.5 v58.42,74.93
N$94
  Bottom 0.254: D1.7 58.42,100.33 59.69,99.06 59.69,90.17 60.96,88.9 R20.2
N$95
  Bottom 0.254: D1.6 60.96,100.33 62.23,99.06 62.23,73.66 R28.2
N$96
  Bottom 0.254: R24.2 59.69,76.2 59.69,88.9 58.42,90.17 D1.4
N$97
  Bottom 0.254: R17.2 D1.2
N$98
  Bottom 0.254: R16.2 D1.1
N$99
  Bottom 0.254: R19.2 58.42,88.9 57.15,90.17 57.15,96.52 53.34,100.33 D1.9
N$100
  Bottom 0.254: R18.2 55.88,88.9 54.61,90.17 54.61,96.52 50.8,100.33 D1.10
N$103  (via drill 0.6)
  Top 0.254: D3.5 37.47,89.54 62.87,89.54 64.14,88.27 91.12,88.27 93.03,86.36 v95.25,86.36
  Bottom 0.254: v95.25,86.36 95.25,76.2 R34.2
N$104
  Top 0.254: R31.2 92.71,87.63 91.44,88.9 64.77,88.9 63.5,90.17 49.53,90.17 D2.5
N$105
  Top 0.254: D1.5 62.23,92.71 85.72,92.71 86.36,92.08 86.36,90.49 87.31,89.54 91.76,89.54 92.39,88.9 95.25,88.9 R32.2
S$1
  pour Top: 4.69,18.49 4.69,19.48 3.66,20.59 4.69,21.15 4.69,22.2 3.06,21.25 1.43,23.03 1.43,22.05 2.47,20.92 1.43,20.36 1.43,19.32 3.09,20.26
  pour Top: 1.43,29.18 1.43,30.06 4.69,29.22 4.69,28.34
  pour Top: 1.43,34.57 2.12,34.4 2.12,31.41 4,30.93 4,33.9 4.69,33.74 4.69,30.45 arc-47 4.58,30.18 arc-36 4.26,30.04 arc-17 4,30.05 arc-5 3.85,30.08 2.27,30.48 arc-33 1.67,30.85 arc-31 1.44,31.23 arc-13 1.43,31.37
  pour Top: 1.43,35.22 2.12,35.92 2.83,35.74 2.83,37.85 2.12,38.03 2.12,35.94 1.43,35.24 1.43,38.37 arc-55 1.64,38.79 arc-31 1.9,38.9 arc-18 2.22,38.87 2.64,38.76 arc-18 2.82,38.68 arc-18 3.22,38.37 arc-19 3.42,38.06 arc-14 3.48,37.71 4.69,38.14 4.69,37.27 3.47,36.83 3.47,35.56 4.69,35.24 4.69,34.37
  pour Top: 4.69,22.79 1.43,23.63 1.43,27.91 arc-50 1.56,28.24 arc-37 1.85,28.37 arc-17 2.23,28.34 4.69,27.7 4.69,26.83 2.12,27.5 2.12,26.36 4.69,25.69 4.69,24.81 2.12,25.48 2.12,24.34 4.69,23.67
  pour Top: 2.12,40.45 2.12,42.54 4,42.04 4,39.92 2.12,40.42 1.43,40.47 1.43,40.37 arc33 1.57,39.98 arc19 1.89,39.69 arc18 2.27,39.51 3.87,39.09 arc9 3.97,39.07 arc9 4.21,39.06 arc22 4.42,39.1 arc36 4.6,39.23 arc17 4.67,39.35 arc13 4.69,39.49 4.69,42.07 arc18 4.67,42.28 arc16 4.57,42.46 arc14 4.35,42.7 arc26 3.88,42.95 2.21,43.39 arc17 1.93,43.41 arc19 1.71,43.37 arc66 1.43,42.99 1.43,40.5
VCC  (via drill 0.6, 0.8)
  Top 0.254: U1.6 55.24,54.61 56.52,53.34 v63.5,53.34 | v40.64,66.04 40.64,68.9 | U3.6 24.77,54.61 23.5,55.88 18.41,55.88 17.14,54.61 U4.6
  Top 0.61: U8.16 40.64,34.29 | U7.16 16.51,34.29 | C10.1 C11.1
  Top 0.813: U1.20 56.52,67.31 54.93,68.9 51.12,68.9 49.53,67.31 U2.20 43.81,67.31 42.23,68.9 40.64,68.9 38.73,68.9 37.15,67.31 U3.20 31.11,67.31 29.53,68.9 26.04,68.9 24.45,67.31 U4.20 18.41,67.31 16.83,68.9 v10.48,68.9
  Top 1.27: v10.48,70.17 v10.48,68.9 v10.48,67.63 | v10.48,34.29 16.51,34.29 40.64,34.29 v64.77,34.29 U9.20 | JP2.3 90.81,91.44 87.95,94.3 57.15,94.3 55.88,95.57 v14.61,95.57 v13.34,95.57 | v10.48,34.29 v10.48,33.02 | v10.48,34.29 v10.48,35.56 | PC1.5 v17.78,9.53 v17.78,10.79 v17.78,12.07
  Bottom 0.254: U4.6 U4.7 U4.8 U4.9 10.48,46.99 | U3.6 U3.7 U3.8 U3.9 | U2.9 U2.8 U2.7 U2.6 40.64,55.88 v40.64,66.04 | U1.6 U1.7 U1.8 U1.9 | U8.6 58.42,29.85 C9.1
  Bottom 0.406: 67.15,29.53 65.09,29.53 64.77,29.85 | 67.47,29.53 69.69,29.53 | 70.01,29.53 72.23,29.53 | 72.55,29.53 74.77,29.53 | 75.09,29.53 77.31,29.53 | 77.63,29.53 79.85,29.53 | 80.17,29.53 82.39,29.53 | 82.71,29.53 84.93,29.53
  Bottom 0.61: C1.1 U1.20 | C8.1 39.37,29.85 40.64,31.12 U8.16 | C7.1 15.24,29.85 16.51,31.12 U7.16 | C9.1 64.77,29.85 U9.20 | C11.1 57.15,16.51 58.42,17.78 U11.20 60.96,21.59 RN2.1 | U10.20 25.4,17.78 24.13,16.51 C10.1 17.78,16.51
  Bottom 0.813: C4.1 U4.20 | C3.1 U3.20 | U2.20 C2.1 | U6.20 67.31,74.93 65.72,76.52 65.72,83.82 | 65.72,83.82 67.31,85.41 U5.20 | C5.1 65.72,83.82 | 67.15,29.53 67.47,29.53 | 69.69,29.53 70.01,29.53 | 72.23,29.53 72.55,29.53 | 74.77,29.53 75.09,29.53 | 77.31,29.53 77.63,29.53 | 79.85,29.53 80.17,29.53 | 82.39,29.53 82.71,29.53 | 84.93,29.53 85.25,29.53
  Bottom 1.27: C6.1 66.04,71.12 | 66.04,71.12 67.31,72.39 U6.20 | 10.48,91.44 v10.48,70.17 v10.48,68.9 v10.48,67.63 10.48,46.99 v10.48,35.56 v10.48,34.29 v10.48,33.02 10.48,23.81 C12.+ 17.78,16.51 v17.78,12.07 v17.78,10.79 v17.78,9.53 PC1.5 | 10.48,91.44 JP1.3 | 66.04,71.12 66.04,67.95 64.77,66.67 64.77,53.34 | 64.77,53.34 v64.77,34.29 U9.20 | v63.5,53.34 64.77,53.34 | v14.61,95.57 v13.34,95.57 10.48,92.71 10.48,91.44

### Text on the board
Top: XMICRO-7SEG | V1 1802
tPlace: GND | GND | COMMON | COMMON | +5V | $01 | $00 | $02 | +5V | CHRIS WEIR 2018
bPlace: CARD ID | 1 | 0 | 0 | 1 | 2 | 3 | 4 | 5 | 6 | 7